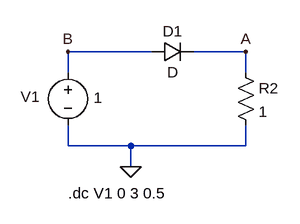
[diagram p0: schematic pn Junction Diode Forward Biased.asc]
pn Junction Diode Forward Biased.asc, the LTspice schematic file:
Version 4
SHEET 1 880 680
WIRE 32 64 -96 64
WIRE 176 64 96 64
WIRE -96 96 -96 64
WIRE 176 96 176 64
WIRE -96 208 -96 176
WIRE 0 208 -96 208
WIRE 176 208 176 176
WIRE 176 208 0 208
WIRE 0 240 0 208
FLAG 0 240 0
FLAG 176 64 A
FLAG -96 64 B
SYMBOL diode 32 80 R270
WINDOW 0 32 32 VTop 2
WINDOW 3 0 32 VBottom 2
SYMATTR InstName D1
SYMBOL res 160 80 R0
SYMATTR InstName R2
SYMATTR Value 1
SYMBOL voltage -96 80 R0
WINDOW 123 0 0 Left 0
WINDOW 39 0 0 Left 0
WINDOW 0 -72 53 Left 2
WINDOW 3 39 54 Left 2
SYMATTR InstName V1
SYMATTR Value 1
TEXT -96 280 Left 2 !.dc V1 0 3 0.5

The netlist it stands for:
* pn Junction Diode Forward Biased.asc
D1 B A D
R2 A 0 1
V1 B 0 1
.model D D
.lib standard.dio
.dc V1 0 3 0.5
.backanno
.end